# Altium schematic sheet 02_Sensor.SchDoc
size A4
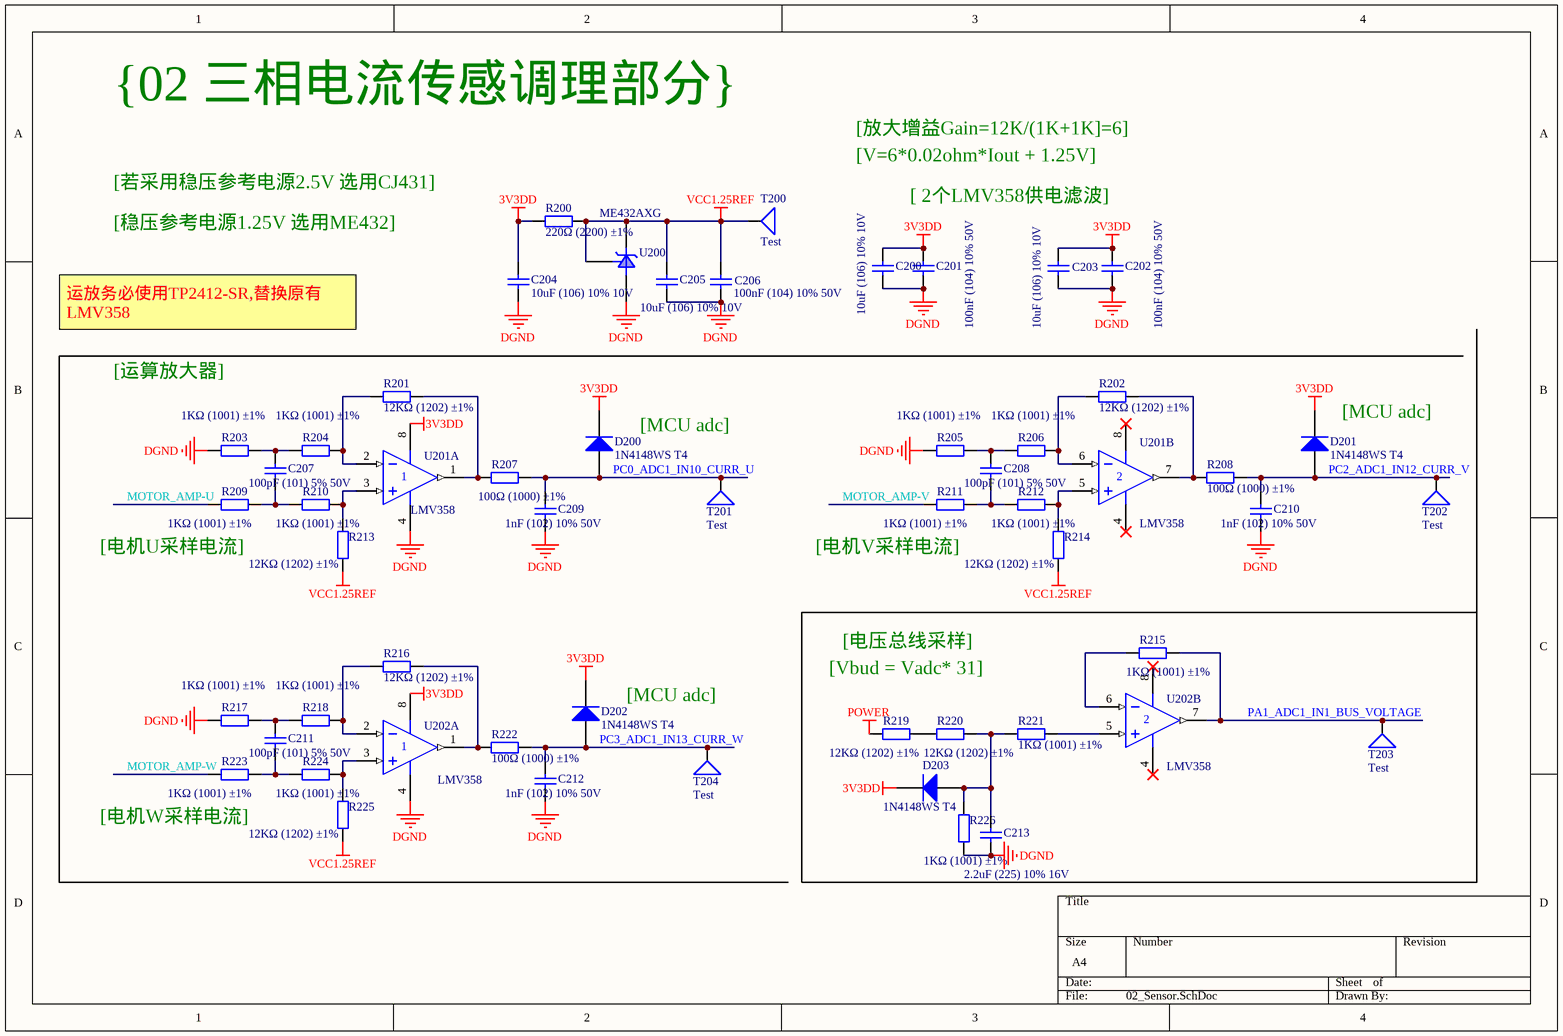
[diagram p0: 02_Sensor.SchDoc]

## Parts
C200  10uF (106) 10% 10V  [LC-0603_C]
C201  100nF (104) 10% 50V  [LC-0603_C]
C202  100nF (104) 10% 50V  [LC-0603_C]
C203  10uF (106) 10% 10V  [LC-0603_C]
C204  10uF (106) 10% 10V  [LC-0603_C]
C205  10uF (106) 10% 10V  [LC-0603_C]
C206  100nF (104) 10% 50V  [LC-0603_C]
C207  100pF (101) 5% 50V  [LC-0603_C]
C208  100pF (101) 5% 50V  [LC-0603_C]
C209  1nF (102) 10% 50V  [LC-0603_C]
C210  1nF (102) 10% 50V  [LC-0603_C]
C211  100pF (101) 5% 50V  [LC-0603_C]
C212  1nF (102) 10% 50V  [LC-0603_C]
C213  2.2uF (225) 10% 16V  [LC-0603_C]
D200  1N4148WS T4  [LC-SOD-323]
D201  1N4148WS T4  [LC-SOD-323]
D202  1N4148WS T4  [LC-SOD-323]
D203  1N4148WS T4  [LC-SOD-323]
R200  220Ω (2200) ±1%  [LC-0603_R]
R201  12KΩ (1202) ±1%  [LC-0603_R]
R202  12KΩ (1202) ±1%  [LC-0603_R]
R203  1KΩ (1001) ±1%  [LC-0603_R]
R204  1KΩ (1001) ±1%  [LC-0603_R]
R205  1KΩ (1001) ±1%  [LC-0603_R]
R206  1KΩ (1001) ±1%  [LC-0603_R]
R207  100Ω (1000) ±1%  [LC-0603_R]
R208  100Ω (1000) ±1%  [LC-0603_R]
R209  1KΩ (1001) ±1%  [LC-0603_R]
R210  1KΩ (1001) ±1%  [LC-0603_R]
R211  1KΩ (1001) ±1%  [LC-0603_R]
R212  1KΩ (1001) ±1%  [LC-0603_R]
R213  12KΩ (1202) ±1%  [LC-0603_R]
R214  12KΩ (1202) ±1%  [LC-0603_R]
R215  1KΩ (1001) ±1%  [LC-0603_R]
R216  12KΩ (1202) ±1%  [LC-0603_R]
R217  1KΩ (1001) ±1%  [LC-0603_R]
R218  1KΩ (1001) ±1%  [LC-0603_R]
R219  12KΩ (1202) ±1%  [LC-0603_R]
R220  12KΩ (1202) ±1%  [LC-0603_R]
R221  1KΩ (1001) ±1%  [LC-0603_R]
R222  100Ω (1000) ±1%  [LC-0603_R]
R223  1KΩ (1001) ±1%  [LC-0603_R]
R224  1KΩ (1001) ±1%  [LC-0603_R]
R225  12KΩ (1202) ±1%  [LC-0603_R]
R226  1KΩ (1001) ±1%  [LC-0603_R]
T200  Test  [Testpoint]
T201  Test  [Testpoint]
T202  Test  [Testpoint]
T203  Test  [Testpoint]
T204  Test  [Testpoint]
U200  ME432AXG  [LC-SOT-23(SOT-23-3)]
U201  LMV358  [TP2412-SR]  (parts A,B of 2)
U202  LMV358  [TP2412-SR]  (parts A,B of 2)

## Nets
3V3DD: C200.2 C201.2 C202.2 C203.2 C204.2 D200.2(K) D201.2(K) D202.2(K) D203.2(K) R200.1 U201.8(V+) U202.8(V+)
DGND: C200.1 C201.1 C202.1 C203.1 C204.1 C205.1 C206.1 C209.1 C210.1 C212.1 C213.1 R203.1 R205.1 R217.1 R226.1 U200.3(A) U201.4(V-) U202.4(V-)
POWER: R219.1
VCC1.25REF: C205.2 C206.2 R200.2 R213.1 R214.1 R225.1 T200.1 U200.1(R) U200.2(K)
MOTOR_AMP-U: R209.1
MOTOR_AMP-V: R211.1
MOTOR_AMP-W: R223.1
PA1_ADC1_IN1_BUS_VOLTAGE: R215.2 T203.1 U202.7(OUT)
PC0_ADC1_IN10_CURR_U: C209.2 D200.1(A) R207.2 T201.1
PC2_ADC1_IN12_CURR_V: C210.2 D201.1(A) R208.2 T202.1
PC3_ADC1_IN13_CURR_W: C212.2 D202.1(A) R222.2 T204.1
NetC207_1: C207.1 R209.2 R210.2
NetC207_2: C207.2 R203.2 R204.2
NetC208_1: C208.1 R211.2 R212.2
NetC208_2: C208.2 R205.2 R206.2
NetC211_1: C211.1 R223.2 R224.2
NetC211_2: C211.2 R217.2 R218.2
NetC213_2: C213.2 D203.1(A) R220.2 R221.2 R226.2
NetR201_1: R201.1 R207.1 U201.1(OUT)
NetR201_2: R201.2 R204.1 U201.2(IN-)
NetR202_1: R202.1 R208.1 U201.7(OUT)
NetR202_2: R202.2 R206.1 U201.6(IN-)
NetR210_1: R210.1 R213.2 U201.3(IN+)
NetR212_1: R212.1 R214.2 U201.5(IN+)
NetR215_1: R215.1 U202.6(IN-)
NetR216_1: R216.1 R222.1 U202.1(OUT)
NetR216_2: R216.2 R218.1 U202.2(IN-)
NetR219_2: R219.2 R220.1
NetR221_1: R221.1 U202.5(IN+)
NetR224_1: R224.1 R225.2 U202.3(IN+)

## Notes on the sheet
- {02 三相电流传感调理部分}
- [放大增益Gain=12K/(1K+1K]=6]
- [V=6*0.02ohm*Iout + 1.25V]
- [若采用稳压参考电源2.5V 选用CJ431]
- [稳压参考电源1.25V 选用ME432]
- [ 2个LMV358供电滤波]
- 运放务必使用TP2412-SR,替换原有LMV358
- [运算放大器]
- [MCU adc]
- (near D201) [MCU adc]
- (near R209) [电机U采样电流]
- (near R211) [电机V采样电流]
- [电压总线采样]
- [Vbud = Vadc* 31]
- (near R223) [电机W采样电流]

## Library data of the parts
C200 C203-C205 = 0603 10uF (106) 10% 10V: 贴片电容; ComponentLink1Description: 供应商链接; ComponentLink1URL: http://www.szlcsc.com/product/details_20411.html; Package: 0603; Supplier: LC; SuppliersPartNumber: C19702
C201 C202 C206 = 0603 100nF (104) 10% 50V: 贴片电容; ComponentLink1Description: 供应商链接; ComponentLink1URL: http://www.szlcsc.com/product/details_15331.html; Package: 0603; Supplier: LC; SuppliersPartNumber: C14663
C207 C208 C211 = 0603 100pF (101) 5% 50V: 贴片电容; ComponentLink1Description: 供应商链接; ComponentLink1URL: http://www.szlcsc.com/product/details_15530.html; Package: 0603; Supplier: LC; SuppliersPartNumber: C14858
C209 C210 C212 = 0603 1nF (102) 10% 50V: 贴片电容; ComponentLink1Description: 供应商链接; ComponentLink1URL: http://www.szlcsc.com/product/details_1940.html; Package: 0603; Supplier: LC; SuppliersPartNumber: C1588
C213 = 0603 2.2uF (225) 10% 16V: 贴片电容; ComponentLink1Description: 供应商链接; ComponentLink1URL: http://www.szlcsc.com/product/details_24366.html; Package: 0603; Supplier: LC; SuppliersPartNumber: C23630
D200-D203 = SOD-323 1N4148WS T4: 二极管; ComponentLink1Description: 供应商链接; ComponentLink1URL: http://www.szlcsc.com/product/details_2485.html; Package: SOD-323; Supplier: LC; SuppliersPartNumber: C2128
R200 = 0603 220Ω (2200) 1%: 贴片电阻; ComponentLink1Description: 供应商链接; ComponentLink1URL: http://www.szlcsc.com/product/details_23689.html; Package: 0603; Supplier: LC; SuppliersPartNumber: C22962
R201 R202 R213 R214 R216 R219 R220 R225 = 0603 12KΩ (1202) 1%: 贴片电阻; ComponentLink1Description: 供应商链接; ComponentLink1URL: http://www.szlcsc.com/product/details_23517.html; Package: 0603; Supplier: LC; SuppliersPartNumber: C22790
R203-R206 R209-R212 R215 R217 R218 R221 R223 R224 R226 = 0603 1KΩ (1001) 1%: 贴片电阻; ComponentLink1Description: 供应商链接; ComponentLink1URL: http://www.szlcsc.com/product/details_21904.html; Package: 0603; Supplier: LC; SuppliersPartNumber: C21190
R207 R208 R222 = 0603 100Ω (1000) 1%: 贴片电阻; ComponentLink1Description: 供应商链接; ComponentLink1URL: http://www.szlcsc.com/product/details_23502.html; Package: 0603; Supplier: LC; SuppliersPartNumber: C22775
T200-T204 = TestPad
U200 = CJ431 0.5%431: 电压基准; ComponentLink1Description: 供应商链接; ComponentLink1URL: http://www.szlcsc.com/product/details_3500.html; Package: SOT-23; Supplier: LC; SuppliersPartNumber: C3113
U201 U202 = LM358DR2G: 通用运放; ComponentLink1Description: 供应商链接; ComponentLink1URL: http://www.szlcsc.com/product/details_8427.html; Package: SOIC-8; Supplier: LC; SuppliersPartNumber: C7950